# Altium schematic sheet Control.SchDoc
size A4; SheetNumber: 3; SheetTotal: 6
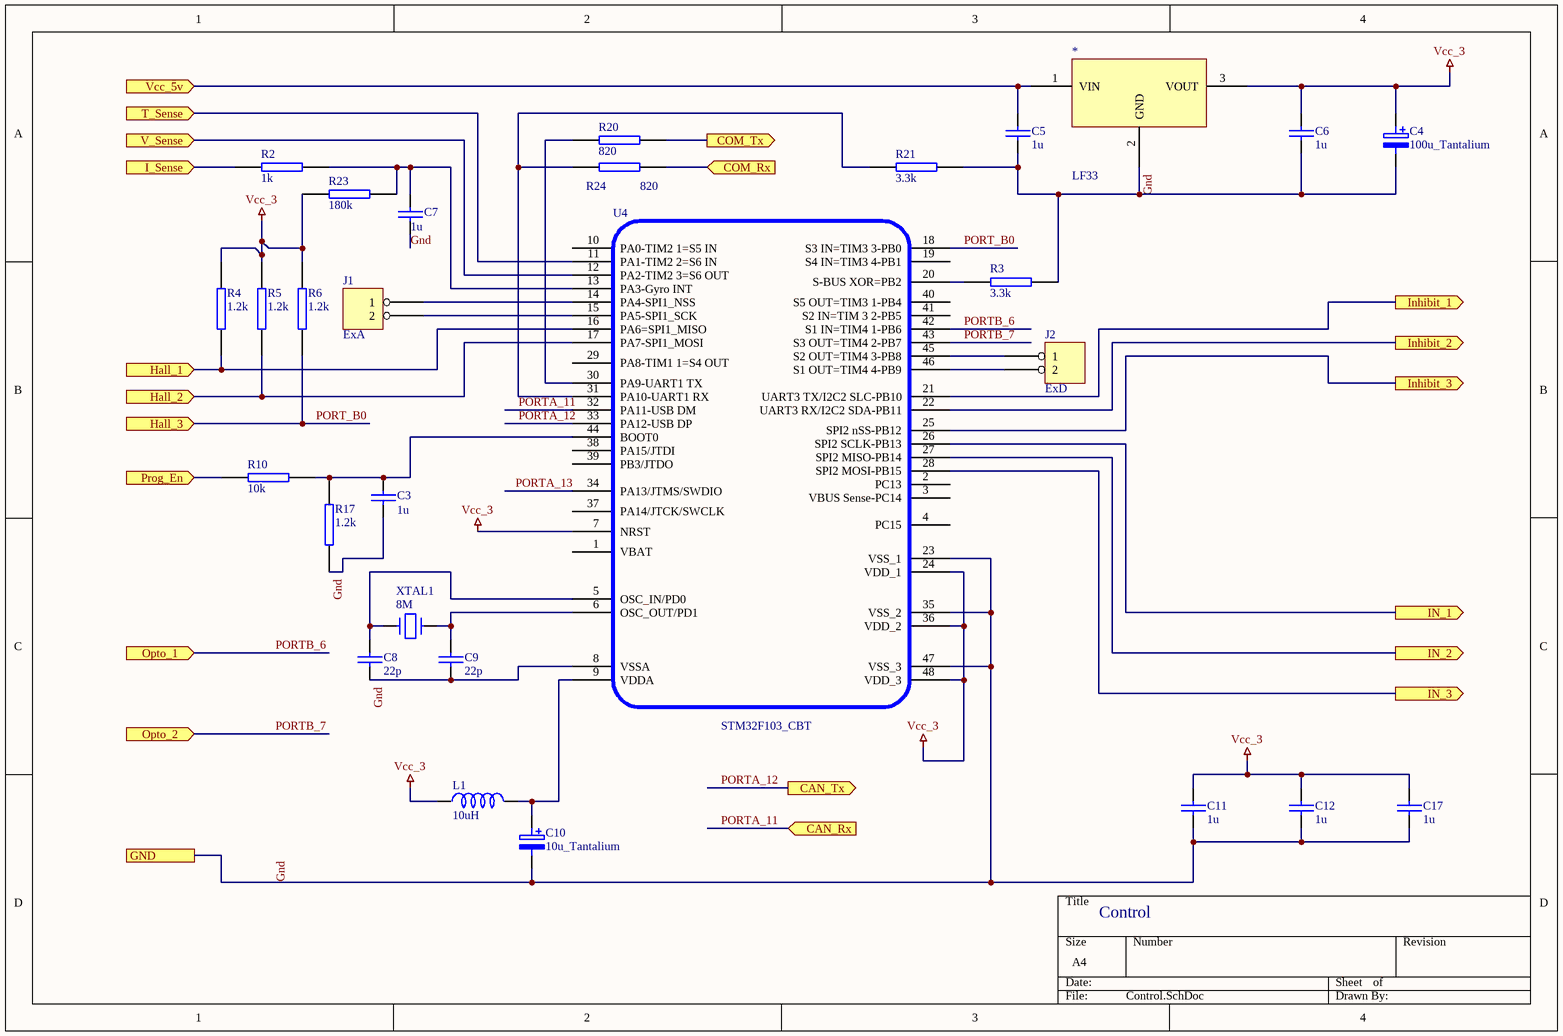
[diagram p0: Control.SchDoc]

## Parts
*  LF33  [Dpak]
C3  1u  [1206_SMD]
C4  100u_Tantalium  [Tantalum_9545]
C5  1u  [1206_SMD]
C6  1u  [1206_SMD]
C7  1u  [1206_SMD]
C8  22p  [0805]
C9  22p  [0805]
C10  10u_Tantalium  [Tantalum_9545]
C11  1u  [1206_SMD]
C12  1u  [1206_SMD]
C17  1u  [1206_SMD]
J1  ExA  [MHDR1X2]
J2  ExD  [MHDR1X2]
L1  10uH  [1206_SMD]
R2  1k  [0805]
R3  3.3k  [0805]
R4  1.2k  [1206_SMD]
R5  1.2k  [1206_SMD]
R6  1.2k  [1206_SMD]
R10  10k  [0805]
R17  1.2k  [0805]
R20  820  [0805]
R21  3.3k  [0805]
R23  180k  [0805]
R24  820  [0805]
U4  STM32F103_CBT  [LQFP48]
XTAL1  8M  [xtal]

## Ports
CAN_Rx (in), CAN_Tx (out), COM_Rx (in), COM_Tx (out), GND, Hall_1 (in), Hall_2 (in), Hall_3 (in), I_Sense (in), IN_1 (out), IN_2 (out), IN_3 (out), Inhibit_1 (out), Inhibit_2 (out), Inhibit_3 (out), Opto_1 (in), Opto_2 (in), Prog_En (in), T_Sense (in), V_Sense (in), Vcc_5v (in)

## Nets
Vcc_3: *.3(VOUT) C4.1 C6.1 C11.1 C12.1 C17.1 L1.1 R4.2 R5.2 R6.2 R23.2 U4.7(NRST) U4.24(VDD_1) U4.36(VDD_2) U4.48(VDD_3)
COM_Rx: R24.1 ; port COM_Rx
COM_Tx: R20.1 ; port COM_Tx
Gnd  : *.2(GND) C3.2 C4.2 C5.2 C6.2 C7.2 C8.2 C9.2 C10.2 C11.2 C12.2 C17.2 R3.1 R17.1 R21.1 U4.8(VSSA) U4.23(VSS_1) U4.35(VSS_2) U4.47(VSS_3) ; port GND
Hall_1: R4.1 U4.16(PA6=SPI1_MISO) ; port Hall_1
Hall_2: R5.1 U4.17(PA7-SPI1_MOSI) ; port Hall_2
I_Sense: R2.1 ; port I_Sense
IN_1: U4.26(SPI2_SCLK-PB13) ; port IN_1
IN_2: U4.27(SPI2_MISO-PB14) ; port IN_2
IN_3: U4.28(SPI2_MOSI-PB15) ; port IN_3
Inhibit_1: U4.21(UART3_TX/I2C2_SLC-PB10) ; port Inhibit_1
Inhibit_2: U4.22(UART3_RX/I2C2_SDA-PB11) ; port Inhibit_2
Inhibit_3: U4.25(SPI2_nSS-PB12) ; port Inhibit_3
PORT_B0: R6.1 U4.18(S3_IN=TIM3_3-PB0) ; port Hall_3
PORTA_11: U4.32(PA11-USB_DM) ; port CAN_Rx
PORTA_12: U4.33(PA12-USB_DP) ; port CAN_Tx
PORTA_13: U4.34(PA13/JTMS/SWDIO)
PORTB_6: U4.42(S1_IN=TIM4_1-PB6) ; port Opto_1
PORTB_7: U4.43(S3_OUT=TIM4_2-PB7) ; port Opto_2
Prog_En: R10.2 ; port Prog_En
T_Sense: U4.11(PA1-TIM2_2=S6_IN) ; port T_Sense
V_Sense: U4.12(PA2-TIM2_3=S6_OUT) ; port V_Sense
Vcc_5v: *.1(VIN) C5.1 ; port Vcc_5v
NetC3_1: C3.1 R10.1 R17.2 U4.44(BOOT0)
NetC7_1: C7.1 R2.2 R23.1 U4.13(PA3-Gyro_INT)
NetC8_1: C8.1 U4.5(OSC_IN/PD0) XTAL1.1
NetC9_1: C9.1 U4.6(OSC_OUT/PD1) XTAL1.2
NetC10_1: C10.1 L1.2 U4.9(VDDA)
NetJ1_1: J1.1 U4.14(PA4-SPI1_NSS)
NetJ1_2: J1.2 U4.15(PA5-SPI1_SCK)
NetJ2_1: J2.1 U4.45(S2_OUT=TIM4_3-PB8)
NetJ2_2: J2.2 U4.46(S1_OUT=TIM4_4-PB9)
NetR3_2: R3.2 U4.20(S-BUS_XOR=PB2)
NetR20_2: R20.2 U4.30(PA9-UART1_TX)
NetR21_2: R21.2 R24.2 U4.31(PA10-UART1_RX)

Not connected (* = marked no-connect by the designer): U4 1(VBAT) 2(PC13) 3(VBUS_Sense-PC14) 4(PC15) 10(PA0-TIM2_1=S5_IN) 19(S4_IN=TIM3_4-PB1) 29(PA8-TIM1_1=S4_OUT) 37(PA14/JTCK/SWCLK) 38(PA15/JTDI) 39(PB3/JTDO) 40(S5_OUT=TIM3_1-PB4) 41(S2_IN=TIM_3_2-PB5)

## Notes on the sheet
- Control

## Library data of the parts
C3 C5-C9 C11 C12 C17 = CAP: Capacitor
C4 C10 = CAP_ELECTRO
J1 J2 = HEADER 2
L1 = INDUCTOR
R2-R6 R10 R17 R20 R21 R23 R24 = RES2
U4 = STM32F103_CBT: ST Microcontroller
XTAL1 = CRYSTAL